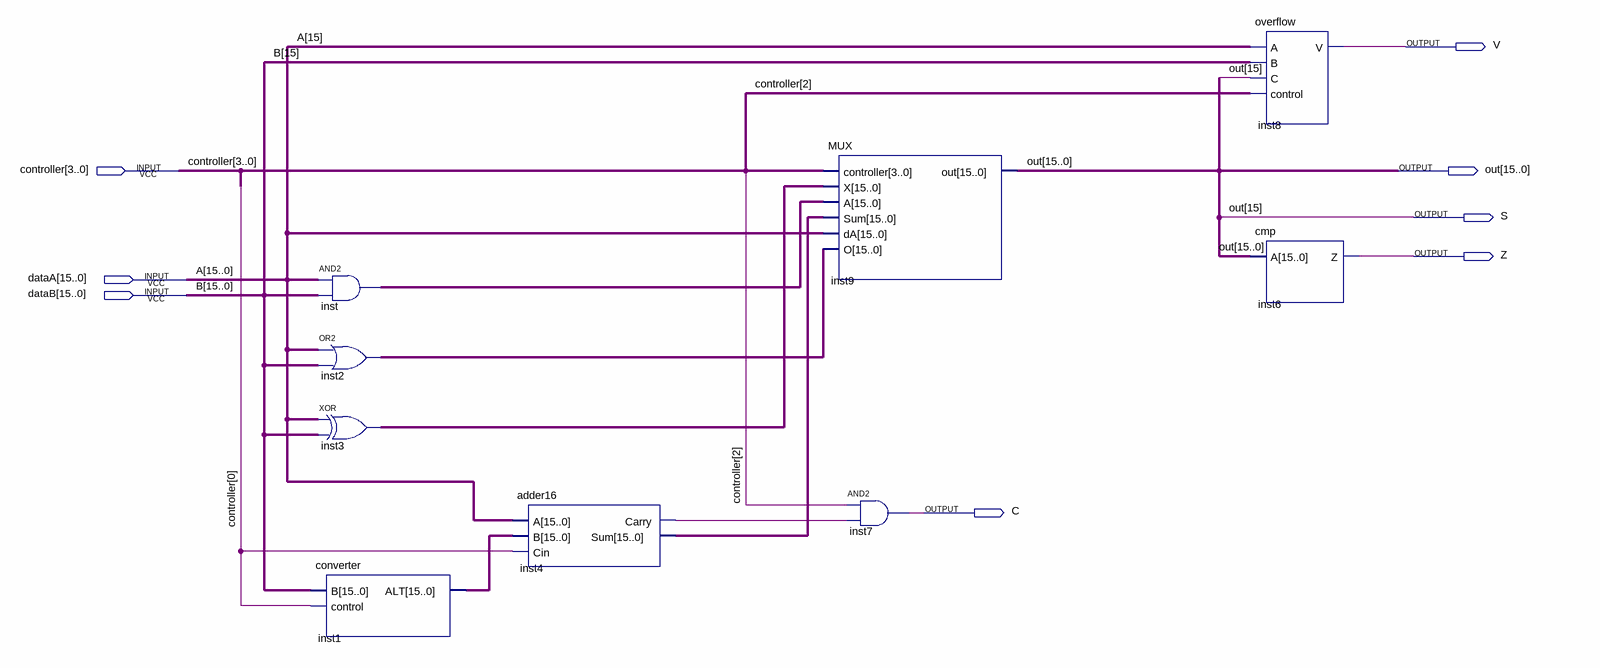
[diagram p0: schematic sheet]
// Quartus schematic ALUdevice.bdf as structural Verilog: 9 symbols, 8 pins
module ALUdevice (
  input  [3:0] controller,
  input  [15:0] dataA,
  input  [15:0] dataB,
  output V,
  output [15:0] out,
  output S,
  output Z,
  output C
);

  wire inst4_carry;
  wire [15:0] inst1_alt, inst2_out, inst3_out, inst4_sum, inst_out;

  assign inst_out = dataA & dataB;  // AND2 inst, 16 bits wide
  assign inst2_out = dataA | dataB;  // OR2 inst2, 16 bits wide
  assign inst3_out = dataA ^ dataB;  // XOR inst3, 16 bits wide
  converter inst1 (.B(dataB), .control(controller[0]), .ALT(inst1_alt));
  adder16 inst4 (.A(dataA), .B(inst1_alt), .Cin(controller[0]), .Carry(inst4_carry), .Sum(inst4_sum));
  MUX inst9 (
    .controller(controller), .X(inst3_out), .A(inst_out), .Sum(inst4_sum), .dA(dataA), .O(inst2_out),
    .out(out));
  and inst7 (C, controller[2], inst4_carry);
  overflow inst8 (.A(dataA[15]), .B(dataB[15]), .C(out[15]), .control(controller[2]), .V(V));
  cmp inst6 (.A(out), .Z(Z));

  assign S = out[15];

  // Other names for the same wires on the sheet: A[15:0] = dataA; B[15:0] = dataB
endmodule
